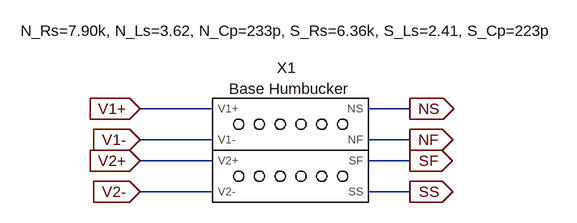
[diagram p0: schematic DiMarzio_Velorum_Bridge_DP265F.asc]
DiMarzio_Velorum_Bridge_DP265F.asc, the LTspice schematic file:
Version 4
SHEET 1 880 680
WIRE 80 160 -32 160
WIRE 384 160 320 160
WIRE 80 208 -32 208
WIRE 384 208 320 208
WIRE 80 240 -32 240
WIRE 384 240 320 240
WIRE 80 288 -32 288
WIRE 384 288 320 288
FLAG -32 160 V1+
IOPIN -32 160 In
FLAG -32 208 V1-
IOPIN -32 208 In
FLAG -32 240 V2+
IOPIN -32 240 In
FLAG -32 288 V2-
IOPIN -32 288 In
FLAG 384 160 NS
IOPIN 384 160 Out
FLAG 384 208 NF
IOPIN 384 208 Out
FLAG 384 240 SF
IOPIN 384 240 Out
FLAG 384 288 SS
IOPIN 384 288 Out
SYMBOL Base_Humbucker 192 224 R0
WINDOW 39 5 -168 Bottom 2
SYMATTR SpiceLine N_Rs=7.90k, N_Ls=3.62, N_Cp=233p, S_Rs=6.36k, S_Ls=2.41, S_Cp=223p
SYMATTR InstName X1

The netlist it stands for:
* DiMarzio_Velorum_Bridge_DP265F.asc
XX1 V1+ V1- V2+ V2- NF NS SF SS Base Humbucker N_Rs=7.90k, N_Ls=3.62, N_Cp=233p, S_Rs=6.36k, S_Ls=2.41, S_Cp=223p  ; pins V1+ V1- V2+ V2- NF NS SF SS
.backanno
.end